# EAGLE design Smart LCDplusRTC (EAGLE 6.5.0)
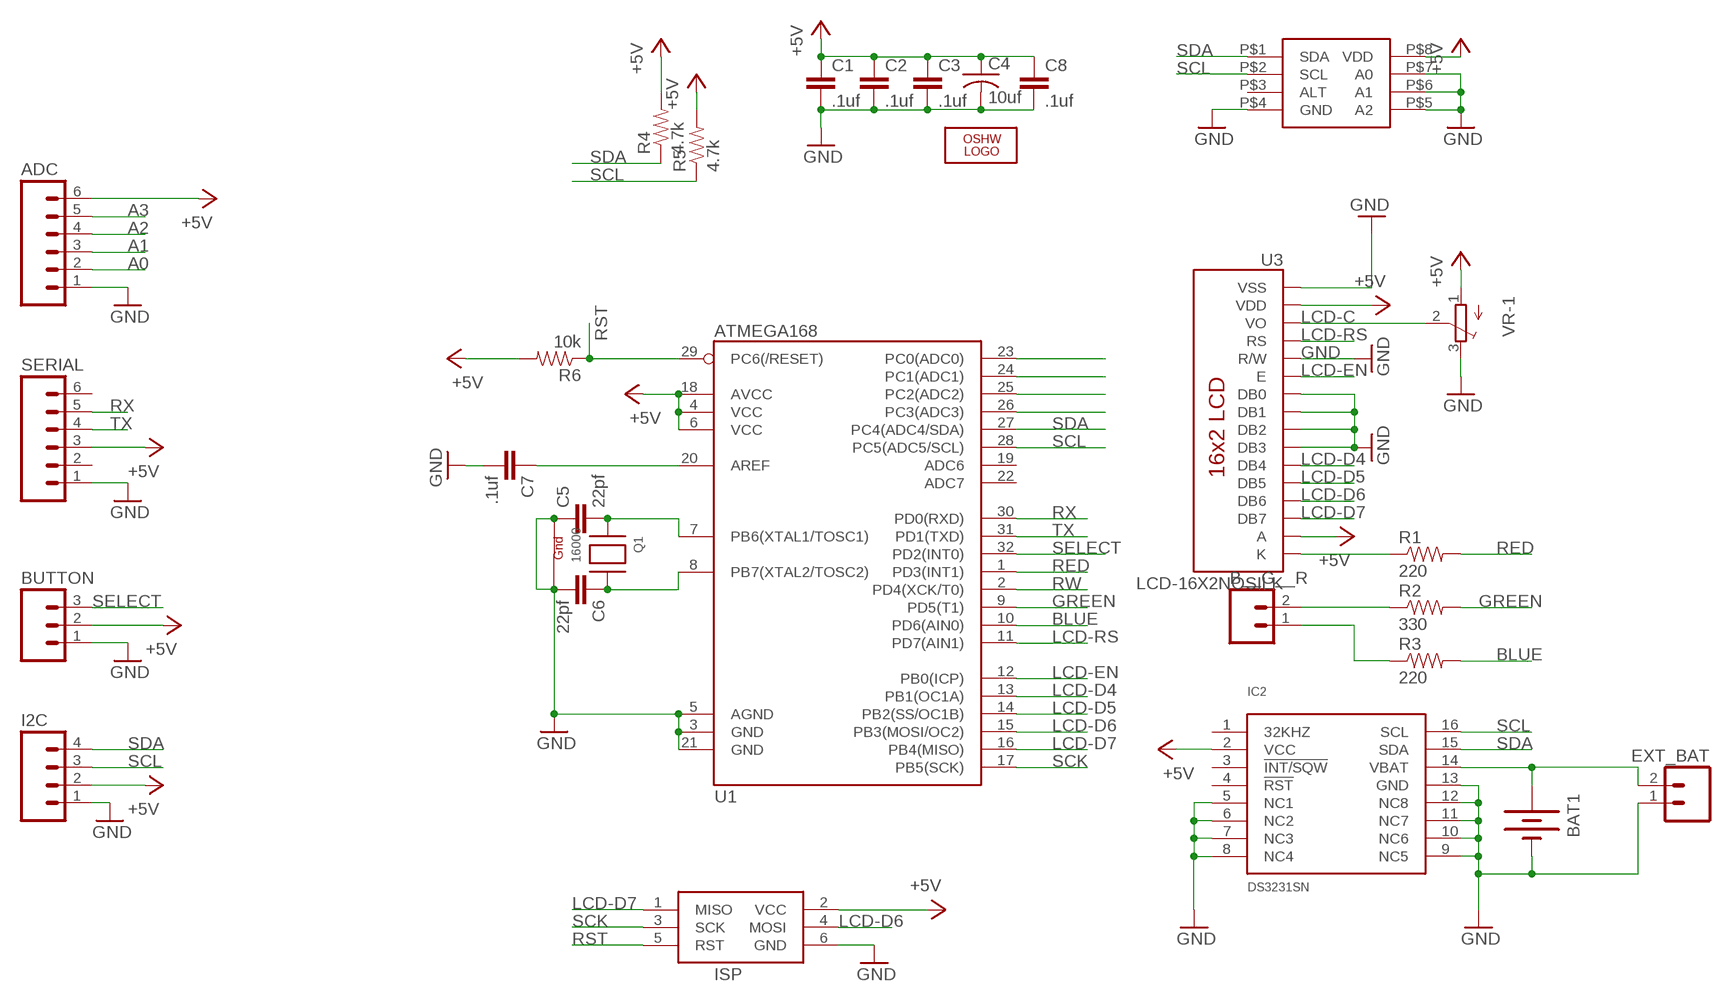
[diagram p0: schematic, sheet 1]

## Parts
ADC  M06SIP_LOCK  [1X06-SIP_LOCK]
B__G__R  M02LOCK  [1X02_LOCK]
BAT1  BATTERY12MM  [BATTCON_12MM]
BUTTON  M03LOCK  [1X03_LOCK]
C1  .1uf  CAP0805  [0805]
C2  .1uf  CAP0805  [0805]
C3  .1uf  CAP0805  [0805]
C4  10uf  C-USC1206  [C1206]
C5  22pf  CAP0805  [0805]
C6  22pf  CAP0805  [0805]
C7  .1uf  CAP0805  [0805]
C8  .1uf  CAP0805  [0805]
EXT_BAT  M02LOCK  [1X02_LOCK]
I2C  M04LOCK  [1X04_LOCK]
IC2  DS3231SN  [SO16W]
ISP  AVRISP-6  [AVRISP]
LOGO2  OSHW_LOGO_10MILX0350-NT  [OSHW_10X350_NOTEXT]
Q1  16000  XTAL-4-3225  [NX3225]
R1  220  RESISTOR0805-RES  [0805]
R2  330  RESISTOR0805-RES  [0805]
R3  220  RESISTOR0805-RES  [0805]
R4  4.7k  RESISTOR0805-RES  [0805]
R5  4.7k  RESISTOR0805-RES  [0805]
R6  10k  RESISTOR0805-RES  [0805]
SERIAL  M06LOCK  [1X06_LOCK]
U1  ATMEGA168  [TQFP32-08]
U3  LCD-16X2NOSILK  [LCD-16X2_NOSILK]
U$1  MCP9808  [MSOP8]
VR-1  TRIMPOTTC33X  [TC33X]

## Nets
+5V: ADC.6 BUTTON.2 C1.1 C2.1 C3.1 C4.1 C8.1 I2C.2 IC2.2(VCC) ISP.2(VCC) R4.2 R5.2 R6.2 SERIAL.3 U1.4(VCC) U1.6(VCC) U1.18(AVCC) U3.2(VDD) U3.15(A) U$1.P$8(VDD) VR-1.1(A)
A0: ADC.2 U1.23(PC0(ADC0))
A1: ADC.3 U1.24(PC1(ADC1))
A2: ADC.4 U1.25(PC2(ADC2))
A3: ADC.5 U1.26(PC3(ADC3))
BLUE: R3.2 U1.10(PD6(AIN0))
GND: ADC.1 BAT1.GND(-) BUTTON.1 C1.2 C2.2 C3.2 C4.2 C5.1 C6.2 C7.2 C8.2 EXT_BAT.1 I2C.1 IC2.5(NC1) IC2.6(NC2) IC2.7(NC3) IC2.8(NC4) IC2.9(NC5) IC2.10(NC6) IC2.11(NC7) IC2.12(NC8) IC2.13(GND) ISP.6(GND) Q1.1(G1) Q1.3(G2) SERIAL.1 U1.3(GND) U1.5(AGND) U1.21(GND) U3.1(VSS) U3.5(R/W) U3.7(DB0) U3.8(DB1) U3.9(DB2) U3.10(DB3) U$1.P$4(GND) U$1.P$5(A2) U$1.P$6(A1) U$1.P$7(A0) VR-1.3(E)
GREEN: R2.2 U1.9(PD5(T1))
LCD-C: U3.3(VO) VR-1.2(S)
LCD-D4: U1.13(PB1(OC1A)) U3.11(DB4)
LCD-D5: U1.14(PB2(SS/OC1B)) U3.12(DB5)
LCD-D6: ISP.4(MOSI) U1.15(PB3(MOSI/OC2)) U3.13(DB6)
LCD-D7: ISP.1(MISO) U1.16(PB4(MISO)) U3.14(DB7)
LCD-EN: U1.12(PB0(ICP)) U3.6(E)
LCD-RS: U1.11(PD7(AIN1)) U3.4(RS)
N$1: B__G__R.2 R2.1
N$2: B__G__R.1 R3.1
N$3: BAT1.PWR@1(+) EXT_BAT.2 IC2.14(VBAT)
N$4: R1.1 U3.16(K)
N$5: C5.2 Q1.2(X1) U1.7(PB6(XTAL1/TOSC1))
N$6: C6.1 Q1.4(X2) U1.8(PB7(XTAL2/TOSC2))
N$44: C7.1 U1.20(AREF)
RED: R1.2 U1.1(PD3(INT1))
RST: ISP.5(RST) R6.1 U1.29(PC6(/RESET))
RW: U1.2(PD4(XCK/T0))
RX: SERIAL.5 U1.30(PD0(RXD))
SCK: ISP.3(SCK) U1.17(PB5(SCK))
SCL: I2C.3 IC2.16(SCL) R5.1 U1.28(PC5(ADC5/SCL)) U$1.P$2(SCL)
SDA: I2C.4 IC2.15(SDA) R4.1 U1.27(PC4(ADC4/SDA)) U$1.P$1(SDA)
SELECT: BUTTON.3 U1.32(PD2(INT0))
TX: SERIAL.4 U1.31(PD1(TXD))
Unconnected: IC2.1(32KHZ) IC2.3(!INT/SQW) IC2.4(!RST) SERIAL.2 SERIAL.6 U1.19(ADC6) U1.22(ADC7) U$1.P$3(ALT)

## Library data of the parts
ADC SERIAL = SparkFun:M06: Header 6 Standard 6-pin 0.1" header. Use with straight break away headers (SKU : PRT-00116), right angle break away headers (PRT-00553), swiss pins (PRT-00743), machine pins (PRT-00117), and female headers (PRT-00115). Molex polarized connector foot print use with SKU : PRT-08094 with associated crimp pins and housings. NOTES ON THE VARIANTS LOCK and LOCK_LONGPADS... This footprint was designed to help hold the alignment of a through-hole component (i.e. 6-pin header) while soldering it into place. You may notice that each hole has been shifted either up or down by 0.005 of an inch from it's more standard position (which is a perfectly straight line). This slight alteration caused the pins (the squares in the middle) to touch the edges of the holes. Because they are alternating, it causes a "brace" to hold the component in place. 0.005 has proven to be the perfect amount of "off-center" position when using our standard breakaway headers. Although looks a little odd when you look at the bare footprint, once you have a header in there, the alteration is very hard to notice. Also, if you push a header all the way into place, it is covered up entirely on the bottom side. This idea of altering the position of holes to aid alignment will be further integrated into the Sparkfun Library for other footprints. It can help hold any component with 3 or more connection pins.
B__G__R EXT_BAT = SparkFun:M02: Header 2 Standard 2-pin 0.1" header. Use with straight break away headers (SKU : PRT-00116), right angle break away headers (PRT-00553), swiss pins (PRT-00743), machine pins (PRT-00117), and female headers (PRT-00115). Molex polarized connector foot print use with SKU : PRT-08233 with associated crimp pins and housings.
BAT1 = SparkFun:BATTERY: Battery Holders Various common sizes : AA, AAA, 20mm coin cell and 12mm coin cell.
BUTTON = SparkFun:M03: Header 3 Standard 3-pin 0.1" header. Use with straight break away headers (SKU : PRT-00116), right angle break away headers (PRT-00553), swiss pins (PRT-00743), machine pins (PRT-00117), and female headers (PRT-00115). Molex polarized connector foot print use with SKU : PRT-08232 with associated crimp pins and housings.
C1-C3 C5-C8 = SparkFun:CAP: Capacitor Standard 0603 ceramic capacitor, and 0.1" leaded capacitor.
C4 = adafruit:C-US: CAPACITOR, American symbol
I2C = SparkFun:M04: Header 4 Standard 4-pin 0.1" header. Use with straight break away headers (SKU : PRT-00116), right angle break away headers (PRT-00553), swiss pins (PRT-00743), machine pins (PRT-00117), and female headers (PRT-00115). Molex polarized connector foot print use with SKU : PRT-08231 with associated crimp pins and housings. 1MM SMD Version SKU: PRT-10208
IC2 = comfile:DS3231SN
ISP = adafruit:AVRISP: AVR ISP HEADER Standard 6 pin header for AVR programming
LOGO2 = ohw-logo:OSHW_LOGO_10MIL
Q1 = adafruit:XTAL-4: Classic 4-pin 3.2 x 2.5mm crystal
R1-R6 = SparkFun:RESISTOR: Resistor Basic schematic elements and footprints for 0603, 1206, and PTH resistors.
U1 = SparkFun:ATMEGA168
U3 = SparkFun:LCD-16X2
U$1 = Qxd:MCP9808
VR-1 = adafruit:TRIMPOT: SMT trimmer potentiometer part number TC33X http://www.ladyada.net/library/eagle

## Board
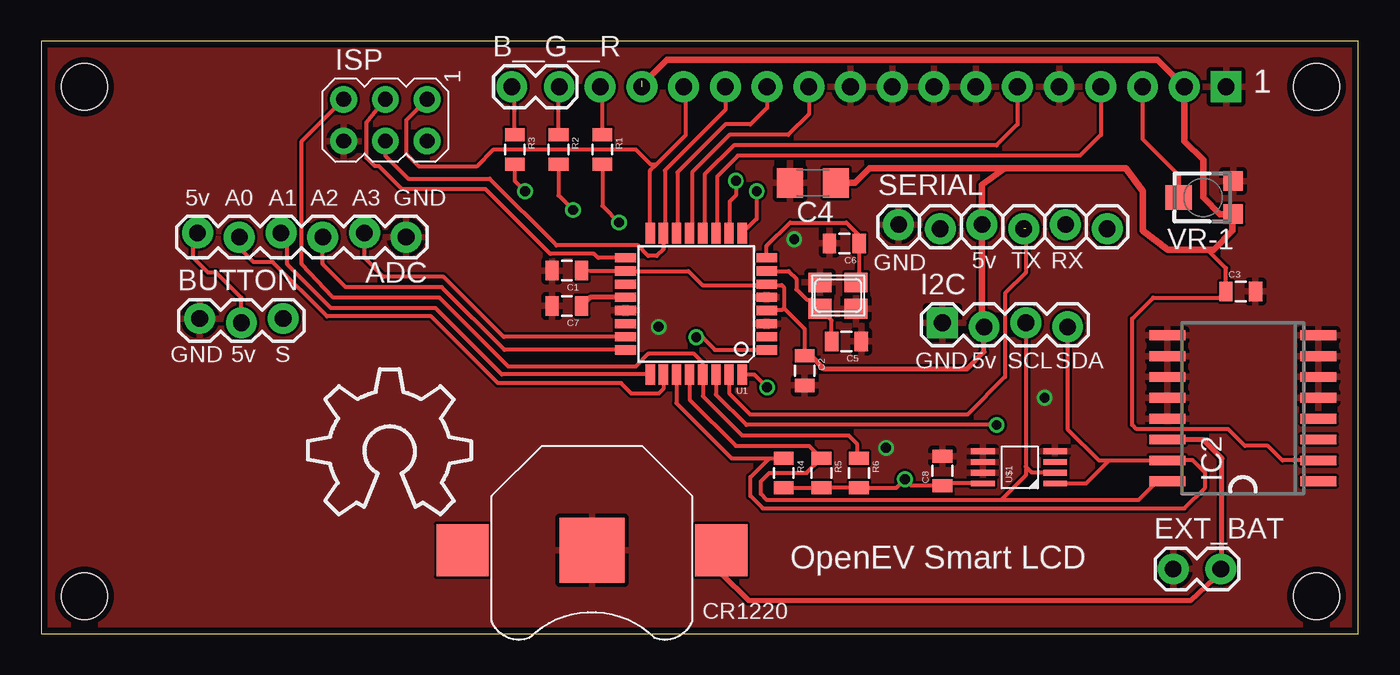
[diagram p1: board, top side]
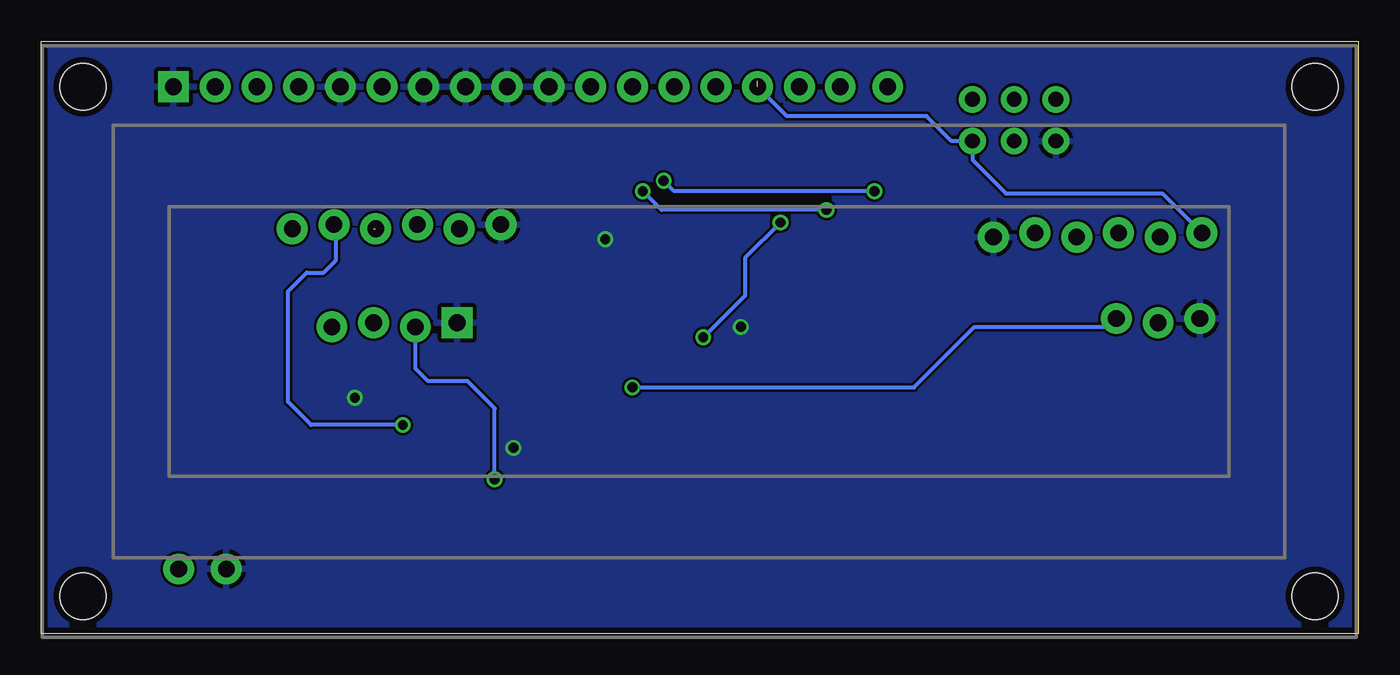
[diagram p2: board, bottom side, seen from below]

Size 80.19 x 36.06 mm. Coordinates in mm from the lower left corner, seen from the top.
Outline: 0,0 80.19,0 80.19,36.06 0,36.06 0,0
Copper layers (1*16): Top 0.0356mm / dielectric 1.5011mm / Bottom 0.0356mm
Design rules "default": minimum track width 6mil, minimum drill 13mil, track to track 6mil, track to pad 6mil, pad to pad 6mil, via to via 6mil, smd to smd 6mil, copper to edge 15mil, drill to drill 6mil, minimum pad ring 7mil, minimum via ring 7mil, stop-mask expansion 4mil, vias tented up to drill 0mil, thermal gap 10mil

### Footprints (pad centres in the part's own frame; a part is rotated, then mirrored left to right if it is on the bottom)
1X06-SIP_LOCK = drill 1.016 pad 1.88: 1 0,0; 2 2.54,-0.254; 3 5.08,0; 4 7.62,-0.254; 5 10.16,0; 6 12.7,-0.254
1X02_LOCK = drill 1.016 pad 1.88: 1 -0.178,0; 2 2.718,0
BATTCON_12MM = smd 3.962 x 3.962: GND 0,0 | smd 3.175 x 3.175: PWR@1 -7.874,0; PWR@2 7.874,0
1X03_LOCK = drill 1.016 pad 1.88: 1 0,0.127; 2 2.54,-0.127; 3 5.08,0.127
0805 = smd 0.8 x 1.2: 1 -0.9,0; 2 0.9,0
C1206 = smd 1.6 x 1.8: 1 -1.4,0; 2 1.4,0
1X04_LOCK = drill 1.016 pad 1.88 square: 1 0,0.127 | drill 1.016 pad 1.88: 2 2.54,-0.127; 3 5.08,0.127; 4 7.62,-0.127
SO16W = smd 0.6 x 2.2: 1 -4.445,-4.6; 2 -3.175,-4.6; 3 -1.905,-4.6; 4 -0.635,-4.6; 5 0.635,-4.6; 6 1.905,-4.6; 7 3.175,-4.6; 8 4.445,-4.6; 9 4.445,4.6; 10 3.175,4.6; 11 1.905,4.6; 12 0.635,4.6; 13 -0.635,4.6; 14 -1.905,4.6; 15 -3.175,4.6; 16 -4.445,4.6
AVRISP = drill 0.9 pad 1.626: 1 -1.27,2.54; 2 1.27,2.54; 3 -1.27,0; 4 1.27,0; 5 -1.27,-2.54; 6 1.27,-2.54
NX3225 = smd 1.4 x 1.2: 1 -1.1,0.8; 2 1.1,0.8; 3 1.1,-0.8; 4 -1.1,-0.8
1X06_LOCK = drill 1.016 pad 1.88: 1 0,0; 2 2.54,-0.254; 3 5.08,0; 4 7.62,-0.254; 5 10.16,0; 6 12.7,-0.254
TQFP32-08 = smd 1.27 x 0.559: 1 -4.293,2.8; 2 -4.293,2; 3 -4.293,1.2; 4 -4.293,0.4; 5 -4.293,-0.4; 6 -4.293,-1.2; 7 -4.293,-2; 8 -4.293,-2.8; 17 4.293,-2.8; 18 4.293,-2; 19 4.293,-1.2; 20 4.293,-0.4; 21 4.293,0.4; 22 4.293,1.2; 23 4.293,2; 24 4.293,2.8 | smd 0.559 x 1.27: 9 -2.8,-4.293; 10 -2,-4.293; 11 -1.2,-4.293; 12 -0.4,-4.293; 13 0.4,-4.293; 14 1.2,-4.293; 15 2,-4.293; 16 2.8,-4.293; 25 2.8,4.293; 26 2,4.293; 27 1.2,4.293; 28 0.4,4.293; 29 -0.4,4.293; 30 -1.2,4.293; 31 -2,4.293; 32 -2.8,4.293
LCD-16X2_NOSILK = drill 1.016 pad 1.88 square: 1 -32,15.5 | drill 1.016 pad 1.88: 2 -29.46,15.5; 3 -26.92,15.5; 4 -24.38,15.5; 5 -21.84,15.5; 6 -19.3,15.5; 7 -16.76,15.5; 8 -14.22,15.5; 9 -11.68,15.5; 10 -9.14,15.5; 11 -6.6,15.5; 12 -4.06,15.5; 13 -1.52,15.5; 14 1.02,15.5; 15 3.56,15.5; 16 6.1,15.5 | hole 2.8: -37.5,15.5; -37.5,-15.5; 37.5,15.5; 37.5,-15.5
MSOP8 = smd 0.35 x 1.45: P$1 0,0; P$2 0.65,0; P$3 1.3,0; P$4 1.95,0; P$5 1.95,4.4; P$6 1.3,4.4; P$7 0.65,4.4; P$8 0,4.4
TC33X = smd 1.2 x 1.2: 1 -1,-1.825; 3 1,-1.825 | smd 1.5 x 1.6: 2 0,1.5

### Placement (x,y rotation side)
ADC  22.23,24.13 180 top
B__G__R  28.83,33.27 0 top
BAT1  33.53,5.08 180 top
BUTTON  9.65,19.05 0 top
C1  32,22.1 180 top
C2  46.48,16 270 top
C3  73.03,20.83 0 top
C4  46.99,27.43 180 top
C5  49.02,17.78 180 top
C6  48.9,23.75 180 top
C7  32,19.94 180 top
C8  54.86,9.91 90 top
EXT_BAT  69.09,3.94 0 top
I2C  54.86,18.8 0 top
IC2  73.15,13.72 90 top
ISP  20.95,31.24 270 top
LOGO2  16.26,7.24 0 top
Q1  48.51,20.57 180 top
R1  34.16,29.46 270 top
R2  31.5,29.46 270 top
R3  28.83,29.46 270 top
R4  45.21,9.78 270 top
R5  47.5,9.78 270 top
R6  49.78,9.78 270 top
SERIAL  52.2,24.89 0 top
U1  39.88,20.07 180 top
U3  40.13,17.78 0 bottom
U$1  61.72,9.14 90 top
VR-1  70.74,26.54 90 top

### Tracks (layer width: path | path; a pad name or v marks a point on that pad's centre or on a via)
+5V  (via drill 0.6)  (1 unrouted)
  Top 0.254: 44.11,21.21 40.26,21.21 39.4,22.07 U1.18 33.44,22.07 C1.1 | 44.11,21.21 U1.6 | 44.11,21.21 45.09,21.21 45.21,21.08 45.21,19.81 | 45.21,19.81 45.09,19.68 44.19,19.68 U1.4 | IC2.2 75.56,10.54 74.68,11.43 73.28,11.43 72.26,12.45 66.67,12.45 66.42,12.7 66.42,19.18 67.69,20.45 71.74,20.45 C3.1 72.12,22.24 70.99,23.37 | R4.2 R5.2 R6.2 52.06,8.88 v52.58,9.4 52.97,9.01 C8.1 55,9.14 U$1.P$8 | BUTTON.2 12.19,20.45 10.67,21.97 10.16,21.97 9.27,22.86 9.27,24.13 ADC.6 | 45.21,19.81 46.48,18.54 C2.1
  Top 0.305: C2.1 46.85,16.9 47.62,16.13 56.39,16.13 57.4,17.14 I2C.2
  Top 0.406: 36.57,33.65 36.83,33.65 38.1,34.92 67.95,34.92 U3.2 69.59,29.98 70.74,28.83 70.74,26.54 71.75,25.53 72.55,25.53 VR-1.1 | 58.67,28.32 57.28,27.3 SERIAL.3 57.28,18.8 I2C.2 | 58.67,28.32 66.04,28.32 67.06,26.92 67.06,24.51 68.58,23.37 70.99,23.37 71.37,23.37 72.52,24.51 72.52,25.5 VR-1.1 | 72.58,25.53 VR-1.1 | C4.1 49.53,27.43 50.42,28.32 58.67,28.32
  Bottom 0.254: U3.15 34.79,31.5 26.29,31.5 24.77,29.97 ISP.2 23.5,28.83 21.46,26.8 11.94,26.8 ADC.6 | v52.58,9.4 52.58,13.72 54.23,15.37 56.64,15.37 57.4,16.13 I2C.2
A0
  Top 0.254: U1.23 28.16,18.07 24.51,21.72 20.83,21.72 19.68,22.86 ADC.2
A1
  Top 0.254: U1.24 28.2,17.27 24.38,21.08 18.54,21.08 17.14,22.48 ADC.3
A2
  Top 0.254: U1.25 28.04,15.77 24,19.81 17.65,19.81 14.99,22.48 14.99,24 ADC.4
A3
  Top 0.254: U1.26 37.88,14.89 37.59,14.61 35.94,14.61 35.31,15.24 27.81,15.24 23.75,19.3 17.4,19.3 14.1,22.61 12.95,22.61 12.06,23.5 ADC.5
BLUE  (via drill 0.6)
  Top 0.254: R3.2 28.83,27.56 v29.46,26.92 | v42.29,27.56 42.29,26.67 41.91,26.29 41.91,24.39 U1.10
  Bottom 0.254: v29.46,26.92 41.66,26.92 v42.29,27.56
GND  (via drill 0.6)
  other vias: 45.85,24 37.59,18.67 61.09,14.35 51.44,11.3
  pour Top: -8,-12.57 94.23,-13.97 94.23,53.34 -8.64,53.34
  pour Bottom: -6.35,-5.84 85.85,-4.45 85.85,45.34 -6.35,43.94
GREEN  (via drill 0.6)
  Top 0.254: 42.68,24.9 U1.9 43.56,25.24 v43.56,26.92 | R2.2 31.5,26.67 v32.38,25.78
  Bottom 0.254: v32.38,25.78 42.42,25.78 v43.56,26.92
LCD-C
  Top 0.254: 69.24,27.92 67.06,30.1 U3.3
  Top 0.305: U3.3 | 69.24,27.92 VR-1.2
LCD-D4
  Top 0.254: U3.11 46.73,31.62 45.47,30.35 41.91,30.35 39.62,28.07 39.62,24.5 U1.13
LCD-D5
  Top 0.254: U3.12 44.19,32 43.18,30.99 41.66,30.99 38.73,28.07 38.73,24.42 U1.14
LCD-D6
  Top 0.254: 37.85,24.39 U1.15 | U3.13 41.65,31.87 37.97,28.19 37.97,24.45 U1.15 | ISP.4 20.95,29.08 22.35,27.69 27.3,27.69 31.37,23.62 36.32,23.62 36.96,22.99 37.47,22.99 37.88,23.4 U1.15
LCD-D7
  Top 0.254: U1.16 37.08,28.19 37.47,28.57 | ISP.1 22.23,31.24 22.23,29.21 22.99,28.45 26.54,28.45 27.56,29.46 36.2,29.46 37.08,28.57 37.47,28.57 | 37.47,28.57 39.24,30.35 39.24,33.15 U3.14
LCD-EN
  Top 0.254: 40.26,24.38 U1.12 40.39,24.47 40.39,27.94 42.16,29.72 58.17,29.72 59.43,30.98 U3.6
LCD-RS
  Top 0.254: 41.02,24.42 U1.11 41.15,24.43 41.15,27.81 42.42,29.08 63.25,29.08 64.51,30.35 U3.4
N$1
  Top 0.254: R2.1 31.5,33.22 B__G__R.2
N$2
  Top 0.254: R3.1 28.83,33.1 B__G__R.1
N$3
  Top 0.305: BAT1.PWR@1 41.4,3.68 43.05,2.03 69.98,2.03 71.88,3.81 71.88,3.86 | 71.88,3.86 71.88,10.67 70.74,11.81 IC2.14 | 71.88,3.86 EXT_BAT.2
N$4
  Top 0.254: R1.1 34.16,33.15 U3.16
N$5
  Top 0.254: C5.2 48.12,19.07 Q1.2 46.87,20.32 46.61,20.32 45.97,20.95 45.97,21.59 45.5,22.07 U1.7
N$6
  Top 0.254: Q1.4 49.8,21.55 C6.1 49.78,23.76 49.78,24.26 49.02,25.02 45.59,25.02 44.17,23.6 U1.8
N$44
  Top 0.254: 35.58,20.46 U1.20
  Top 0.305: U1.20 33.43,20.47 C7.1
RED  (via drill 0.6)
  Top 0.254: 33.77,28.56 R1.2 34.16,26.04 v35.18,25.02 | v39.88,18.03 40.26,18.03 41.02,17.27 U1.1
  Bottom 0.254: v35.18,25.02 37.34,22.86 37.34,20.57 v39.88,18.03
RST
  Top 0.254: R6.1 49.66,10.81 49.66,11.56 49.15,12.06 42.67,12.06 40.28,14.46 U1.29 40.28,16.49 39.75,17.02 36.96,17.02 36.2,16.26 28.45,16.26 24.26,20.45 17.78,20.45 15.88,22.48 15.88,29.97 ISP.5
RX  (via drill 0.6)
  Top 0.254: U1.30 41.08,14.55 42.93,12.7 v58.17,12.7
  Bottom 0.254: v58.17,12.7 63.75,12.7 65.15,14.1 65.15,20.83 64.01,21.97 62.99,21.97 62.23,22.73 62.23,24.77 SERIAL.5
SCK
  Top 0.254: U1.17 33.9,22.87 33.66,23.11 30.99,23.11 27.05,27.05 21.97,27.05 20.57,28.45 20.32,28.45 19.81,28.96 19.81,31.11 ISP.3
SCL
  Top 0.254: U1.28 39.48,14.24 42.29,11.43 46.75,11.43 R5.1 | R5.1 47.87,10.68 | IC2.16 68.42,9.14 67.82,9.14 66.8,8.13 58.42,8.13 | 58.42,8.13 44.2,8.13 43.81,8.51 43.81,9.27 44.32,9.78 46.6,9.78 R5.1 | I2C.3 59.94,10.16 | 59.94,10.16 59.94,9.65 58.42,8.13 | U$1.P$2 60.31,9.79 59.94,10.16
SDA
  Top 0.254: U1.27 38.68,14.03 42.04,10.67 44.32,10.67 | 44.32,10.67 45.2,10.67 R4.1 44.84,10.68 | 44.32,10.67 43.18,9.53 43.18,8.38 43.94,7.62 69.6,7.62 70.87,8.89 70.87,9.78 70.1,10.54 IC2.15 65.02,10.54 | I2C.4 62.48,12.45 64.39,10.54 65.02,10.54 | U$1.P$1 63.63,9.14 65.02,10.54
SELECT  (via drill 0.6)
  Top 0.254: U1.32 43.41,15.77 v44.2,14.99
  Bottom 0.254: v44.2,14.99 27.05,14.99 23.37,18.67 15.24,18.67 BUTTON.3
TX  (1 unrouted)
  Top 0.254: U1.31 41.88,14.64 43.18,13.34 56.39,13.34 58.67,15.62 58.67,20.7 59.94,21.97 59.94,24.64

### Text on the board
tNames: 1 | 5v | A0 | A1 | A2 | A3 | GND | GND | 5v | TX | RX | GND | 5v | S | GND | 5v | SCL | SDA | OpenEV Smart LCD | CR1220